# Altium schematic sheet MISC.schdoc
size 312 x 205 mm
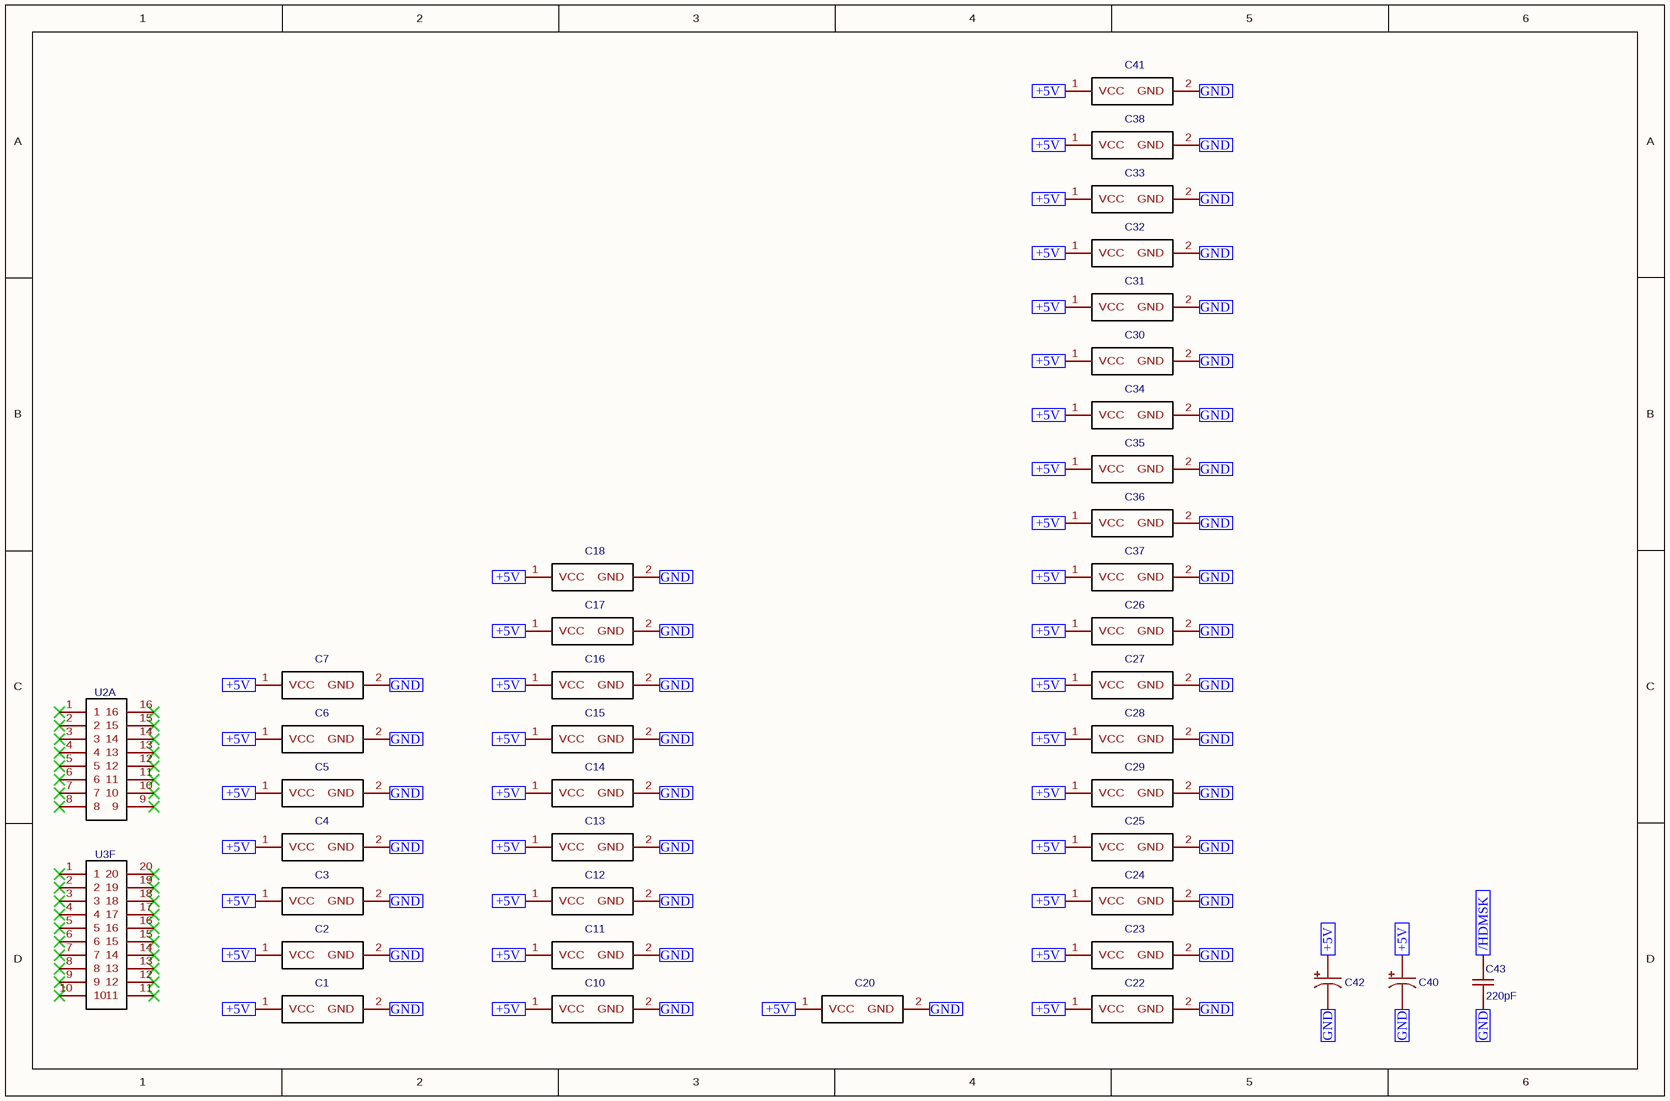
[diagram p0: MISC.schdoc]

## Parts
C1  LISA_CPU_DECOUPLER_CERAMIC_CAP  [CERAMIC_CAP_LISA]  (value not drawn)
C2  LISA_CPU_DECOUPLER_CERAMIC_CAP  [CERAMIC_CAP_LISA]  (value not drawn)
C3  LISA_CPU_DECOUPLER_CERAMIC_CAP  [CERAMIC_CAP_LISA]  (value not drawn)
C4  LISA_CPU_DECOUPLER_CERAMIC_CAP  [CERAMIC_CAP_LISA]  (value not drawn)
C5  LISA_CPU_DECOUPLER_CERAMIC_CAP  [CERAMIC_CAP_LISA]  (value not drawn)
C6  LISA_CPU_DECOUPLER_CERAMIC_CAP  [CERAMIC_CAP_LISA]  (value not drawn)
C7  LISA_CPU_DECOUPLER_CERAMIC_CAP  [CERAMIC_CAP_LISA]  (value not drawn)
C10  LISA_CPU_DECOUPLER_CERAMIC_CAP  [CERAMIC_CAP_LISA]  (value not drawn)
C11  LISA_CPU_DECOUPLER_CERAMIC_CAP  [CERAMIC_CAP_LISA]  (value not drawn)
C12  LISA_CPU_DECOUPLER_CERAMIC_CAP  [CERAMIC_CAP_LISA]  (value not drawn)
C13  LISA_CPU_DECOUPLER_CERAMIC_CAP  [CERAMIC_CAP_LISA]  (value not drawn)
C14  LISA_CPU_DECOUPLER_CERAMIC_CAP  [CERAMIC_CAP_LISA]  (value not drawn)
C15  LISA_CPU_DECOUPLER_CERAMIC_CAP  [CERAMIC_CAP_LISA]  (value not drawn)
C16  LISA_CPU_DECOUPLER_CERAMIC_CAP  [CERAMIC_CAP_LISA]  (value not drawn)
C17  LISA_CPU_DECOUPLER_CERAMIC_CAP  [CERAMIC_CAP_LISA]  (value not drawn)
C18  LISA_CPU_DECOUPLER_CERAMIC_CAP  [CERAMIC_CAP_LISA]  (value not drawn)
C20  LISA_CPU_DECOUPLER_CERAMIC_CAP  [CERAMIC_CAP_LISA]  (value not drawn)
C22  LISA_CPU_DECOUPLER_CERAMIC_CAP  [CERAMIC_CAP_LISA]  (value not drawn)
C23  LISA_CPU_DECOUPLER_CERAMIC_CAP  [CERAMIC_CAP_LISA]  (value not drawn)
C24  LISA_CPU_DECOUPLER_CERAMIC_CAP  [CERAMIC_CAP_LISA]  (value not drawn)
C25  LISA_CPU_DECOUPLER_CERAMIC_CAP  [CERAMIC_CAP_LISA]  (value not drawn)
C26  LISA_CPU_DECOUPLER_CERAMIC_CAP  [CERAMIC_CAP_LISA]  (value not drawn)
C27  LISA_CPU_DECOUPLER_CERAMIC_CAP  [CERAMIC_CAP_LISA]  (value not drawn)
C28  LISA_CPU_DECOUPLER_CERAMIC_CAP  [CERAMIC_CAP_LISA]  (value not drawn)
C29  LISA_CPU_DECOUPLER_CERAMIC_CAP  [CERAMIC_CAP_LISA]  (value not drawn)
C30  LISA_CPU_DECOUPLER_CERAMIC_CAP  [CERAMIC_CAP_LISA]  (value not drawn)
C31  LISA_CPU_DECOUPLER_CERAMIC_CAP  [CERAMIC_CAP_LISA]  (value not drawn)
C32  LISA_CPU_DECOUPLER_CERAMIC_CAP  [CERAMIC_CAP_LISA]  (value not drawn)
C33  LISA_CPU_DECOUPLER_CERAMIC_CAP  [CERAMIC_CAP_LISA]  (value not drawn)
C34  LISA_CPU_DECOUPLER_CERAMIC_CAP  [CERAMIC_CAP_LISA]  (value not drawn)
C35  LISA_CPU_DECOUPLER_CERAMIC_CAP  [CERAMIC_CAP_LISA]  (value not drawn)
C36  LISA_CPU_DECOUPLER_CERAMIC_CAP  [CERAMIC_CAP_LISA]  (value not drawn)
C37  LISA_CPU_DECOUPLER_CERAMIC_CAP  [CERAMIC_CAP_LISA]  (value not drawn)
C38  LISA_CPU_DECOUPLER_CERAMIC_CAP  [CERAMIC_CAP_LISA]  (value not drawn)
C40  LISA_CPU_AXIAL_CAP  [LISA_CPU_AXIAL_CAP]  (value not drawn)
C41  LISA_CPU_DECOUPLER_CERAMIC_CAP  [CERAMIC_CAP_LISA]  (value not drawn)
C42  LISA_CPU_AXIAL_CAP  [LISA_CPU_AXIAL_CAP]  (value not drawn)
C43  220pF  [LISA_DISC_CERAMIC_CAPACITOR]
U2A  LISA_EMPTY_DIP_16  [LISA_DIP_16]  (value not drawn)
U3F  LISA_EMPTY_DIP_20  [LISA_DIP_20]  (value not drawn)

## Ports
+5V (in), /HDMSK (in), GND (in)

## Nets
+5V: C1.1(VCC) C2.1(VCC) C3.1(VCC) C4.1(VCC) C5.1(VCC) C6.1(VCC) C7.1(VCC) C10.1(VCC) C11.1(VCC) C12.1(VCC) C13.1(VCC) C14.1(VCC) C15.1(VCC) C16.1(VCC) C17.1(VCC) C18.1(VCC) C20.1(VCC) C22.1(VCC) C23.1(VCC) C24.1(VCC) C25.1(VCC) C26.1(VCC) C27.1(VCC) C28.1(VCC) C29.1(VCC) C30.1(VCC) C31.1(VCC) C32.1(VCC) C33.1(VCC) C34.1(VCC) C35.1(VCC) C36.1(VCC) C37.1(VCC) C38.1(VCC) C40.1 C41.1(VCC) C42.1 ; port +5V
/HDMSK: C43.2 ; port /HDMSK
GND: C1.2(GND) C2.2(GND) C3.2(GND) C4.2(GND) C5.2(GND) C6.2(GND) C7.2(GND) C10.2(GND) C11.2(GND) C12.2(GND) C13.2(GND) C14.2(GND) C15.2(GND) C16.2(GND) C17.2(GND) C18.2(GND) C20.2(GND) C22.2(GND) C23.2(GND) C24.2(GND) C25.2(GND) C26.2(GND) C27.2(GND) C28.2(GND) C29.2(GND) C30.2(GND) C31.2(GND) C32.2(GND) C33.2(GND) C34.2(GND) C35.2(GND) C36.2(GND) C37.2(GND) C38.2(GND) C40.2 C41.2(GND) C42.2 C43.1 ; port GND

Not connected (* = marked no-connect by the designer): U2A 1* 2* 3* 4* 5* 6* 7* 8* 9* 10* 11* 12* 13* 14* 15* 16*; U3F 1* 2* 3* 4* 5* 6* 7* 8* 9* 10* 11* 12* 13* 14* 15* 16* 17* 18* 19* 20*

## Library data of the parts
C1-C7 C10-C18 C20 C22-C38 C41 = LISA_CPU_DECOUPLER_CERAMIC_CAP: Contributor: William Tooker; spicePre: C; spiceSymbolName: LISA_CPU_DECOUPLER_CERAMIC_CAP
C40 C42 = LISA_CPU_AXIAL_CAP: Contributor: William Tooker; spicePre: C; spiceSymbolName: LISA_CPU_AXIAL_CAP
C43 = 220pF: Contributor: William Tooker; Package Display: No; spicePre: C; spiceSymbolName: LISA_CPU_CERAMIC_CAP
U2A = LISA_EMPTY_DIP_16: Contributor: William Tooker; spicePre: U; spiceSymbolName: LISA_EMPTY_DIP_16
U3F = LISA_EMPTY_DIP_20: Contributor: William Tooker; spicePre: U; spiceSymbolName: LISA_EMPTY_DIP_20